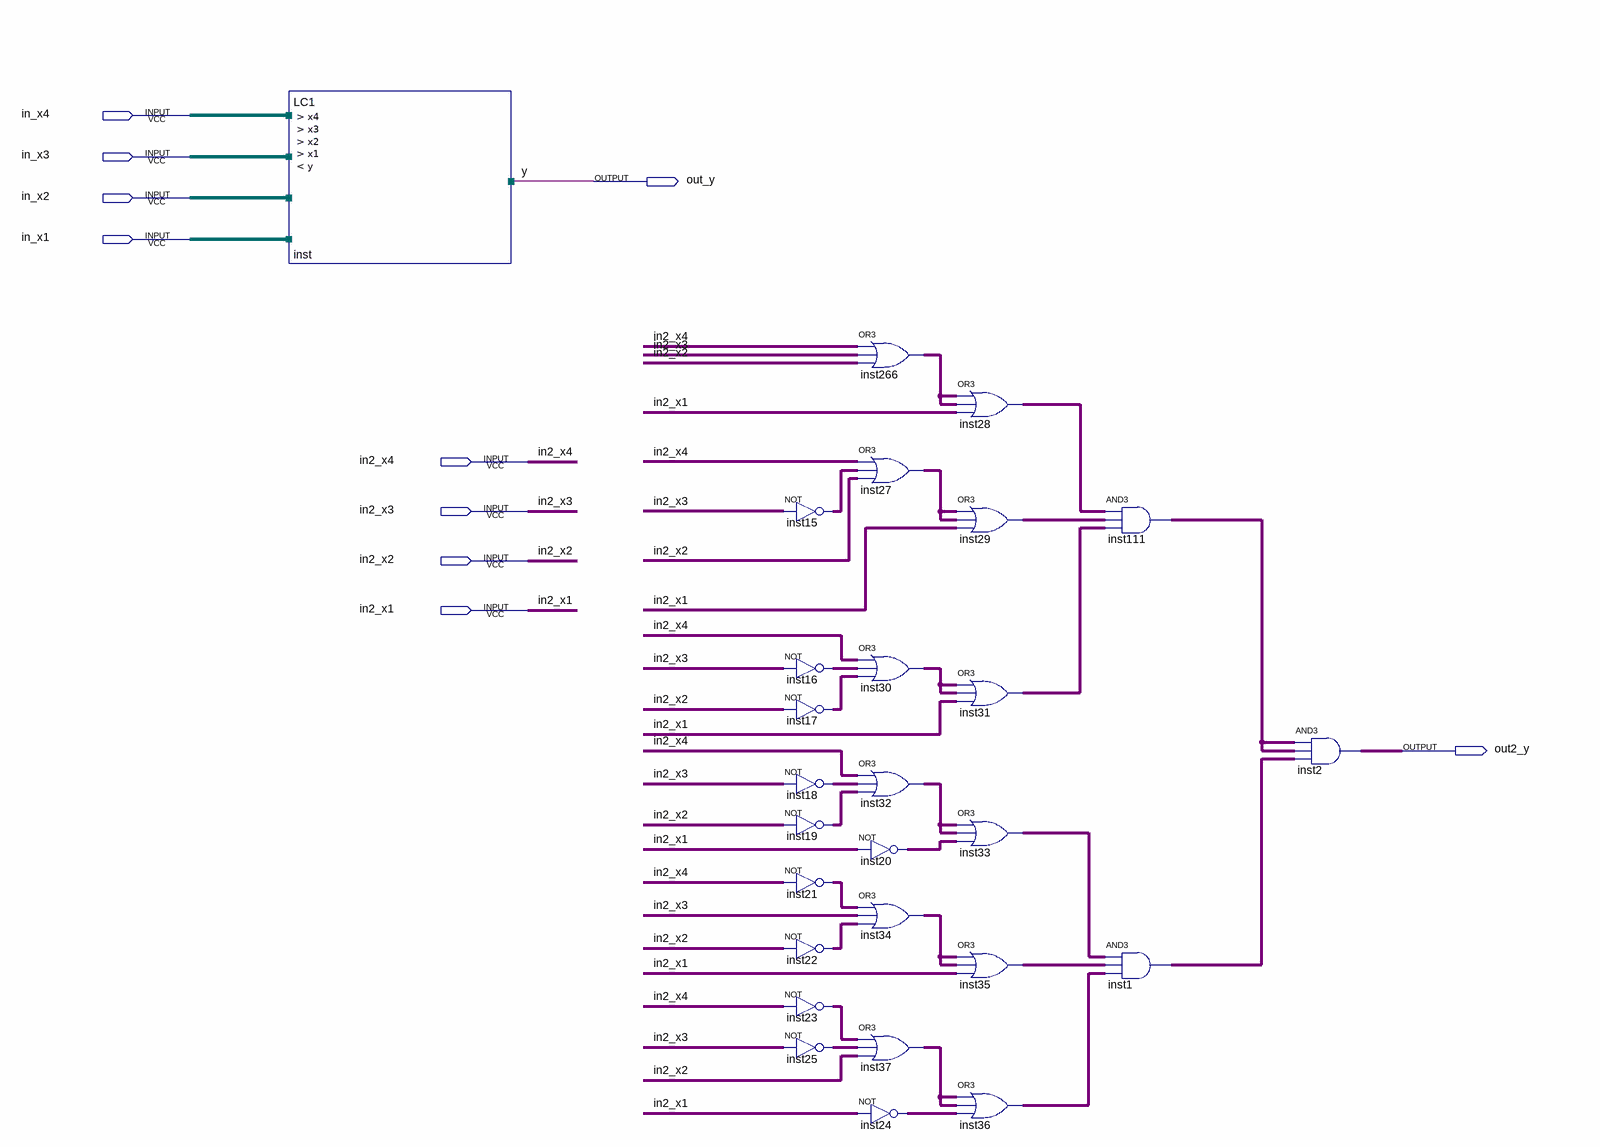
[diagram p0: schematic sheet]
// Quartus schematic CL_Dominskyi_v1.bdf as structural Verilog: 27 symbols, 10 pins
module CL_Dominskyi_v1 (
  input  in_x4,
  input  in_x3,
  input  in_x2,
  input  in_x1,
  input  in2_x4,
  input  in2_x3,
  input  in2_x2,
  input  in2_x1,
  output out_y,
  output out2_y
);

  wire inst1_out, inst15_out, inst16_out, inst17_out, inst18_out, inst19_out, inst20_out, inst21_out,
       inst22_out, inst23_out, inst24_out, inst25_out, inst27_out, inst28_out, inst29_out, inst30_out,
       inst31_out, inst32_out, inst33_out, inst34_out, inst35_out, inst36_out, inst37_out, inst111_out,
       inst266_out;

  LC1 inst (.x4(in_x4), .x3(in_x3), .x2(in_x2), .x1(in_x1), .y(out_y));
  not inst15 (inst15_out, in2_x3);
  not inst16 (inst16_out, in2_x3);
  not inst17 (inst17_out, in2_x2);
  not inst18 (inst18_out, in2_x3);
  not inst19 (inst19_out, in2_x2);
  not inst21 (inst21_out, in2_x4);
  not inst22 (inst22_out, in2_x2);
  not inst23 (inst23_out, in2_x4);
  not inst25 (inst25_out, in2_x3);
  or inst266 (inst266_out, in2_x4, in2_x3, in2_x2);
  or inst27 (inst27_out, in2_x4, inst15_out, in2_x2);
  or inst30 (inst30_out, in2_x4, inst16_out, inst17_out);
  or inst32 (inst32_out, in2_x4, inst18_out, inst19_out);
  not inst20 (inst20_out, in2_x1);
  or inst34 (inst34_out, inst21_out, in2_x3, inst22_out);
  or inst37 (inst37_out, inst23_out, inst25_out, in2_x2);
  not inst24 (inst24_out, in2_x1);
  or inst28 (inst28_out, inst266_out, inst266_out, in2_x1);
  or inst29 (inst29_out, inst27_out, inst27_out, in2_x1);
  or inst31 (inst31_out, inst30_out, inst30_out, in2_x1);
  or inst33 (inst33_out, inst32_out, inst32_out, inst20_out);
  or inst35 (inst35_out, inst34_out, inst34_out, in2_x1);
  or inst36 (inst36_out, inst37_out, inst37_out, inst24_out);
  and inst111 (inst111_out, inst28_out, inst29_out, inst31_out);
  and inst1 (inst1_out, inst33_out, inst35_out, inst36_out);
  and inst2 (out2_y, inst111_out, inst111_out, inst1_out);

  // Other names for the same wires on the sheet: y = out_y
endmodule
